# Altium schematic sheet kijek_d1.SchDoc: 3D CANDLE - czujniki
size A4; Address1: Jacek Martyniak; Address2: £ukasz Nowarkiewicz; DocumentNumber: 2017-03; Revision: 1.0; SheetNumber: 1; SheetTotal: 1; PageSetup: Record=PageOptions|CenterHorizontal=True|CenterVertical=True|PrintScale=0.98|XCorrection=1.00|YCorrection=1.00|PrintKind=0|BorderSize=5000000|LeftOffset=0|BottomOffset=0|Orientation=2|PaperLength=1000|PaperWidth=1000|Scale=100|PaperSource=7|PrintQuality=-4|MediaType=1|DitherType=10|PaperKind=A4|PrintScaleMode=1
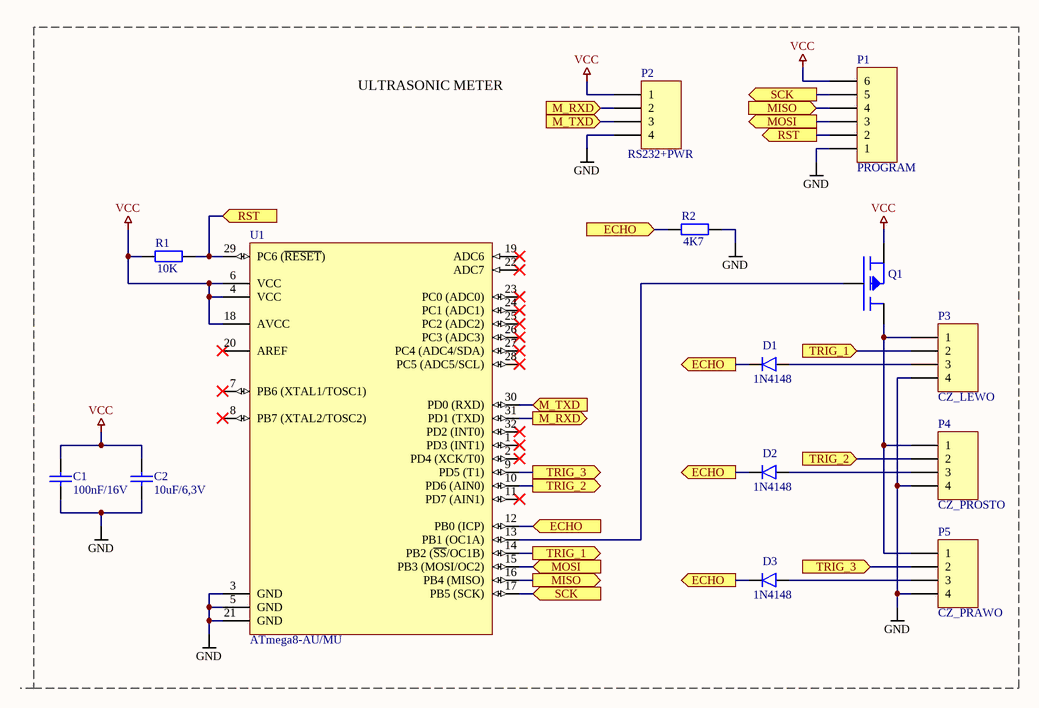
[diagram p0: kijek_d1.SchDoc]

## Parts
C1  100nF/16V  [C0402]
C2  10uF/6,3V  [C0603]
D1  1N4148  [DO-213A]
D2  1N4148  [DO-213A]
D3  1N4148  [DO-213A]
P1  PROGRAM  [SMA06-1]
P2  RS232+PWR  [MA04-1]
P3  CZ_LEWO  [MA04-1]
P4  CZ_PROSTO  [MA04-1]
P5  CZ_PRAWO  [MA04-1]
Q1  AO3401  [SOT23]  (value not drawn)
R1  10K  [R0402]
R2  4K7  [R0402]
U1  ATmega8-AU/MU  [TQFP-32A]

## Ports
ECHO (in), ECHO (out), M_RXD, M_RXD (out), M_TXD, M_TXD (in), MISO (in), MISO (out), MOSI (in), MOSI (out), RST (in), RST (out), SCK (in), SCK (out), TRIG_1 (in), TRIG_1 (out), TRIG_2 (in), TRIG_2 (out), TRIG_3 (in), TRIG_3 (out)

## Nets
GND: C1.2 C2.2 P1.1 P2.4 P3.4 P4.4 P5.4 R2.2 U1.3(GND) U1.5(GND) U1.21(GND)
VCC: C1.1 C2.1 P1.6 P2.1 Q1.2(S) R1.1 U1.4(VCC) U1.6(VCC) U1.18(AVCC)
ECHO: D1.1 D2.1 D3.1 R2.1 U1.12(PB0_(ICP)) ; port ECHO
M_RXD: P2.2 U1.31(PD1_(TXD)) ; port M_RXD
M_TXD: P2.3 U1.30(PD0_(RXD)) ; port M_TXD
MISO: P1.4 U1.16(PB4_(MISO)) ; port MISO
MOSI: P1.3 U1.15(PB3_(MOSI/OC2)) ; port MOSI
RST: P1.2 R1.2 U1.29(PC6_(~{RESET})) ; port RST
SCK: P1.5 U1.17(PB5_(SCK)) ; port SCK
TRIG_1: P3.2 U1.14(PB2_(~{SS}/OC1B)) ; port TRIG_1
TRIG_2: P4.2 U1.10(PD6_(AIN0)) ; port TRIG_2
TRIG_3: P5.2 U1.9(PD5_(T1)) ; port TRIG_3
NetD1_2: D1.2 P3.3
NetD2_2: D2.2 P4.3
NetD3_2: D3.2 P5.3
NetP3_1: P3.1 P4.1 P5.1 Q1.3(D)
NetQ1_1: Q1.1(G) U1.13(PB1_(OC1A))

Not connected (* = marked no-connect by the designer): U1 1(PD3_(INT1))* 2(PD4_(XCK/T0))* 7(PB6_(XTAL1/TOSC1))* 8(PB7_(XTAL2/TOSC2))* 11(PD7_(AIN1))* 19(ADC6)* 20(AREF)* 22(ADC7)* 23(PC0_(ADC0))* 24(PC1_(ADC1))* 25(PC2_(ADC2))* 26(PC3_(ADC3))* 27(PC4_(ADC4/SDA))* 28(PC5_(ADC5/SCL))* 32(PD2_(INT0))*

## Notes on the sheet
- ULTRASONIC METER
- Title
- Size:
- Date:
- A4
- Number:
- Time:
- Revision:
- Sheet
- of
- File:

## Library data of the parts
C1 C2 = Cap: Capacitor
D1-D3 = Diode
P1 = Header 6: Header, 6-Pin
P2-P5 = Header 4: Header, 4-Pin
R1 R2 = Res: Resistor
U1 = ATmega8-AU/MU: TQFP - 32pin / MLF - 32pin; DatasheetVersion: revZ, Feb-2011; PackageVersion: revC, Oct-2010; PackageReference: 32A; PackageDescription: 32-Lead, 7x7x1.0 mm Body, 0.8mm Lead Pitch, Thin Profile Plastic Quad Flat Package (TQFP); Code_JEDEC: MS-026-ABA; ComponentLink1Description: Manufacturer URL; ComponentLink1URL: http://www.atmel.com/; ComponentLink2Description: ATmega8(L); ComponentLink2URL: http://www.atmel.com/dyn/resources/prod_documents/doc2486.pdf; ComponentLink3Description: ATmega8(L) Summary; ComponentLink3URL: http://www.atmel.com/dyn/resources/prod_documents/2486S.pdf